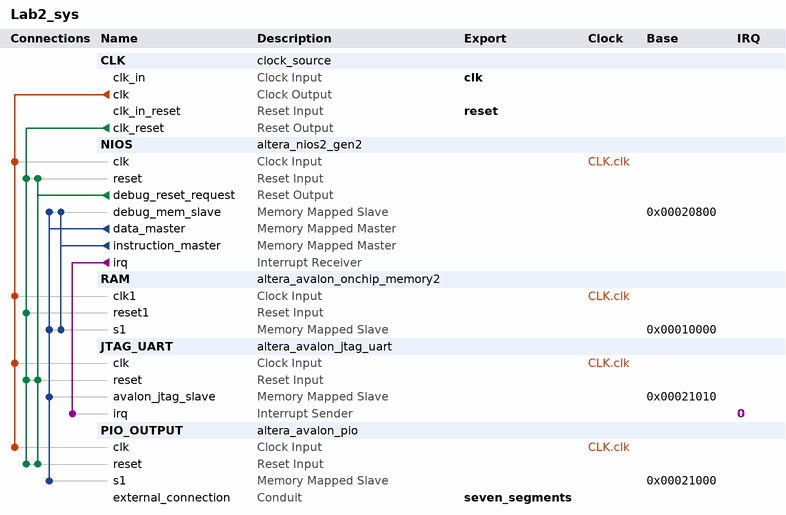
[diagram p0: system contents]
# Platform Designer (Qsys) system Lab2_sys, MAX 10 10M50DAF484C7G
# Parameters at their usual value, and those the tool derives, are not listed.
package require -exact qsys 18.1
create_system Lab2_sys
set_project_property DEVICE_FAMILY {MAX 10}
set_project_property DEVICE 10M50DAF484C7G

add_instance CLK clock_source 18.1
set_instance_parameter_value CLK clockFrequency 50000000

add_instance NIOS altera_nios2_gen2 18.1
set_instance_parameter_value NIOS dcache_size 2048
set_instance_parameter_value NIOS exceptionSlave RAM.s1
set_instance_parameter_value NIOS icache_size 4096
set_instance_parameter_value NIOS impl Tiny
set_instance_parameter_value NIOS resetSlave RAM.s1

add_instance RAM altera_avalon_onchip_memory2 18.1
set_instance_parameter_value RAM dataWidth 32
set_instance_parameter_value RAM dualPort false
set_instance_parameter_value RAM initMemContent false
set_instance_parameter_value RAM initializationFileName onchip_mem.hex
set_instance_parameter_value RAM memorySize 40000

add_instance JTAG_UART altera_avalon_jtag_uart 18.1
set_instance_parameter_value JTAG_UART simInteractiveOptions NO_INTERACTIVE_WINDOWS

add_instance PIO_OUTPUT altera_avalon_pio 18.1
set_instance_parameter_value PIO_OUTPUT direction Output
set_instance_parameter_value PIO_OUTPUT width 8

# connections
add_connection CLK.clk JTAG_UART.clk clock
add_connection CLK.clk NIOS.clk clock
add_connection CLK.clk PIO_OUTPUT.clk clock
add_connection CLK.clk RAM.clk1 clock
add_connection CLK.clk_reset JTAG_UART.reset reset
add_connection CLK.clk_reset NIOS.reset reset
add_connection CLK.clk_reset PIO_OUTPUT.reset reset
add_connection CLK.clk_reset RAM.reset1 reset
add_connection NIOS.debug_reset_request JTAG_UART.reset reset
add_connection NIOS.debug_reset_request NIOS.reset reset
add_connection NIOS.debug_reset_request PIO_OUTPUT.reset reset
add_connection NIOS.data_master JTAG_UART.avalon_jtag_slave avalon
set_connection_parameter_value NIOS.data_master/JTAG_UART.avalon_jtag_slave baseAddress 0x00021010
add_connection NIOS.data_master NIOS.debug_mem_slave avalon
set_connection_parameter_value NIOS.data_master/NIOS.debug_mem_slave baseAddress 0x00020800
add_connection NIOS.data_master PIO_OUTPUT.s1 avalon
set_connection_parameter_value NIOS.data_master/PIO_OUTPUT.s1 baseAddress 0x00021000
add_connection NIOS.data_master RAM.s1 avalon
set_connection_parameter_value NIOS.data_master/RAM.s1 baseAddress 0x00010000
add_connection NIOS.instruction_master NIOS.debug_mem_slave avalon
set_connection_parameter_value NIOS.instruction_master/NIOS.debug_mem_slave baseAddress 0x00020800
add_connection NIOS.instruction_master RAM.s1 avalon
set_connection_parameter_value NIOS.instruction_master/RAM.s1 baseAddress 0x00010000
add_connection NIOS.irq JTAG_UART.irq interrupt
set_connection_parameter_value NIOS.irq/JTAG_UART.irq irqNumber 0

# exported interfaces
add_interface clk clock sink
set_interface_property clk EXPORT_OF CLK.clk_in
add_interface reset reset sink
set_interface_property reset EXPORT_OF CLK.clk_in_reset
add_interface seven_segments conduit end
set_interface_property seven_segments EXPORT_OF PIO_OUTPUT.external_connection

set_interconnect_requirement {$system} qsys_mm.clockCrossingAdapter HANDSHAKE
set_interconnect_requirement {$system} qsys_mm.enableEccProtection FALSE
set_interconnect_requirement {$system} qsys_mm.insertDefaultSlave FALSE
set_interconnect_requirement {$system} qsys_mm.maxAdditionalLatency 1

save_system Lab2_sys.qsys
